# Altium schematic sheet EEG_Electrodes.SchDoc
size 330 x 101 mm; SheetNumber: 1; SheetTotal: 2
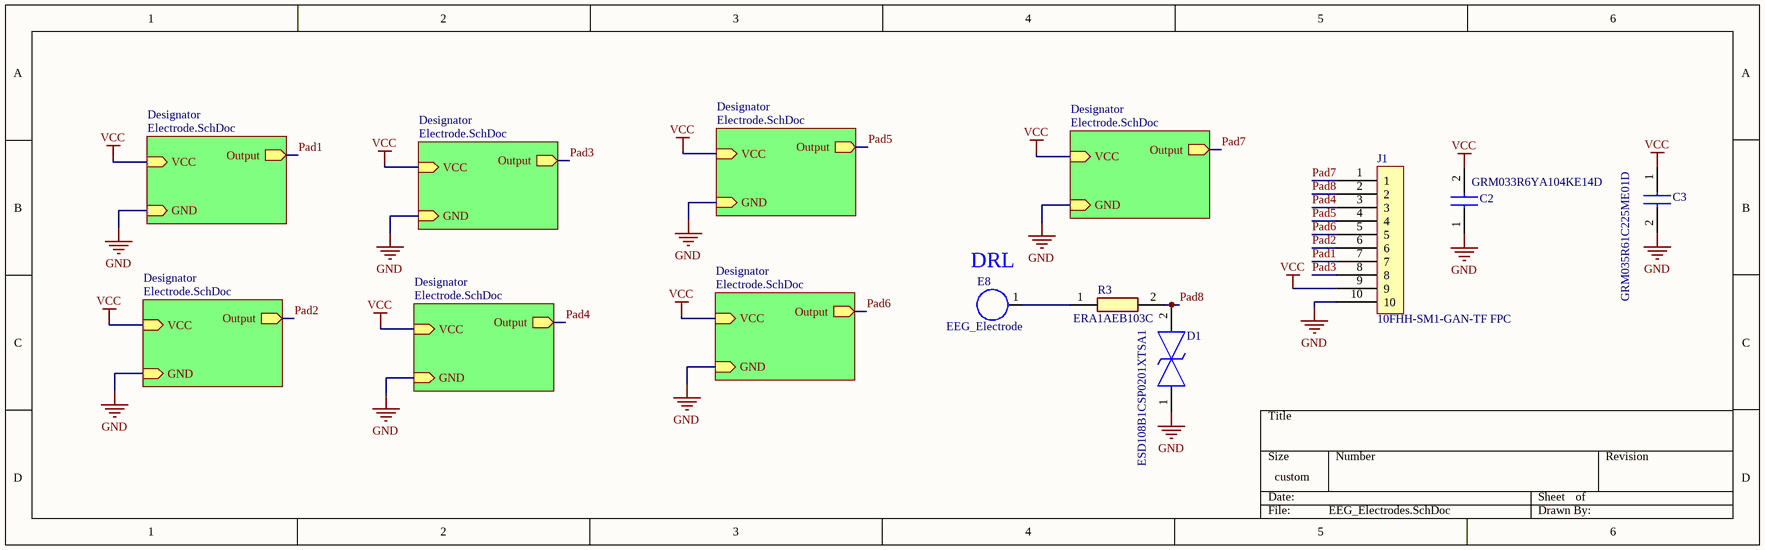
[diagram p0: EEG_Electrodes.SchDoc]

## Parts
C2  GRM033R6YA104KE14D  [CAPC0603X33N]
C3  GRM035R61C225ME01D  [GRM033D70J224ME01D]
D1  ESD108B1CSP0201XTSA1  [ESD108B1CSP0201XTSA1]
E8  EEG_Electrode  [EEG_Electrode]
J1  10FHH-SM1-GAN-TF FPC  [10FHH-SM1-GAN-TF FPC]
R3  ERA1AEB103C  [ERA1A_(0201)]

## Sub-sheets
Designator = Electrode.SchDoc: Output (out), GND (in), VCC (in)
Designator = Electrode.SchDoc: Output (out), GND (in), VCC (in)
Designator = Electrode.SchDoc: Output (out), GND (in), VCC (in)
Designator = Electrode.SchDoc: Output (out), GND (in), VCC (in)
Designator = Electrode.SchDoc: Output (out), GND (in), VCC (in)
Designator = Electrode.SchDoc: Output (out), GND (in), VCC (in)
Designator = Electrode.SchDoc: Output (out), GND (in), VCC (in)

## Nets
GND: C2.1 C3.2 D1.1 J1.10 ; sheet Designator/GND, sheet Designator/GND, sheet Designator/GND, sheet Designator/GND, sheet Designator/GND, sheet Designator/GND, sheet Designator/GND
VCC: C2.2 C3.1 J1.9 ; sheet Designator/VCC, sheet Designator/VCC, sheet Designator/VCC, sheet Designator/VCC, sheet Designator/VCC, sheet Designator/VCC, sheet Designator/VCC
Pad1: J1.7 ; sheet Designator/Output
Pad2: J1.6 ; sheet Designator/Output
Pad3: J1.8 ; sheet Designator/Output
Pad4: J1.3 ; sheet Designator/Output
Pad5: J1.4 ; sheet Designator/Output
Pad6: J1.5 ; sheet Designator/Output
Pad7: J1.1 ; sheet Designator/Output
Pad8: D1.2 J1.2 R3.2
NetE8_1: E8.1 R3.1

## Notes on the sheet
- (near E8) DRL

## Library data of the parts
C2 = GRM033R6YA104KE14D: Capacitor 0.1uF 0201; Manufacturer_Name: Murata Electronics; Datasheet Link: https://search.murata.co.jp/Ceramy/image/img/A01X/G101/ENG/GRM033R6YA104KE14-01A.pdf; Height: 0.33mm; Manufacturer_Part_Number: GRM033R6YA104KE14D; Mouser Part Number: 81-GRM33R6YA104KE14D; Mouser Price/Stock: https://www.mouser.co.uk/ProductDetail/Murata-Electronics/GRM033R6YA104KE14D?qs=P%2FC4Eoq9CDwTt3wOuyKhXw%3D%3D; Arrow Part Number: GRM033R6YA104KE14D; Arrow Price/Stock: https://www.arrow.com/en/products/grm033r6ya104ke14d/murata-manufacturing?utm_currency=USD&region=europe
C3 = GRM035R61C225ME01D: Capacitor 2.2uF 0201; Manufacturer_Name: Murata Electronics; Datasheet Link: https://search.murata.co.jp/Ceramy/image/img/A01X/G101/ENG/GRM035R61C225ME01-01A.pdf; Height: 0.33mm; Manufacturer_Part_Number: GRM035R61C225ME01D; Mouser Part Number: 81-GRM035R61C225ME1D; Mouser Price/Stock: https://www.mouser.co.uk/ProductDetail/Murata-Electronics/GRM035R61C225ME01D?qs=DPoM0jnrROXTliYh3Jmu1A%3D%3D
D1 = ESD108B1CSP0201XTSA1: TVS Diode (Bi-directional); Manufacturer_Name: Infineon; Datasheet Link: https://www.infineon.com/dgdl/Infineon-ESD108-B1-CSP0201-DS-v01_00-EN.pdf?fileId=5546d4624b0b249c014b1746e4d05aa8; Height: 0.16mm; Manufacturer_Part_Number: ESD108B1CSP0201XTSA1; Mouser Part Number: 726-ESD108B1CSP0201X; Mouser Price/Stock: https://www.mouser.co.uk/ProductDetail/Infineon-Technologies/ESD108B1CSP0201XTSA1?qs=3Bi3m9r5MQZFyNTZtNMRAQ%3D%3D; Arrow Part Number: ESD108B1CSP0201XTSA1; Arrow Price/Stock: https://www.arrow.com/en/products/esd108b1csp0201xtsa1/infineon-technologies-ag?region=nac
R3 = ERA1AEB103C: Resistor 10k; Manufacturer_Name: Panasonic; Datasheet Link: http://industrial.panasonic.com/cdbs/www-data/pdf/RDM0000/AOA0000C307.pdf; Height: 0.26mm; Manufacturer_Part_Number: ERA1AEB103C